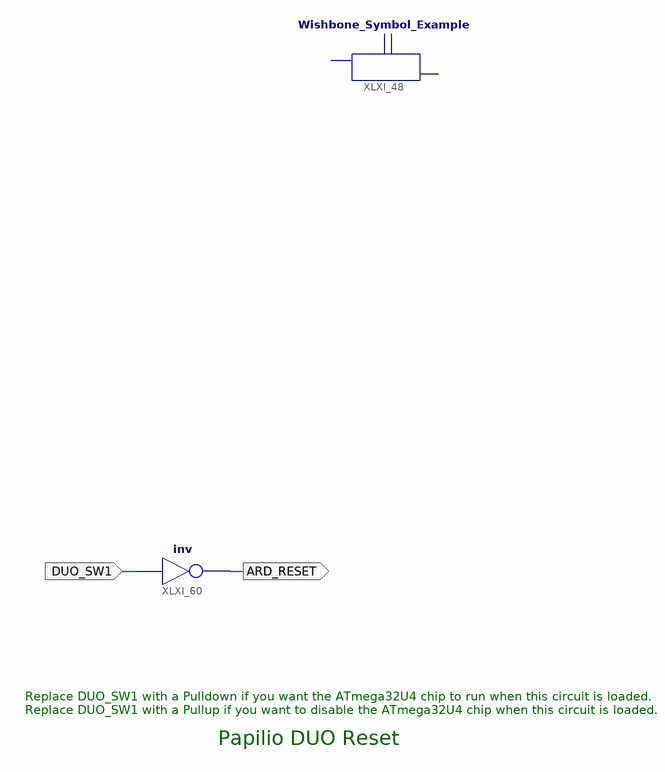
[diagram p0: schematic sheet 1]
// Xilinx ISE schematic Papilio_DUO_LX9.sch (spartan6) as structural Verilog: 2 symbols, 2 ports
module Papilio_DUO_LX9 (
  input  DUO_SW1,
  output ARD_RESET
);

  Wishbone_Symbol_Example XLXI_48 ();  // open: buttons, leds, wishbone_in, wishbone_out
  not XLXI_60 (ARD_RESET, DUO_SW1);

  // Notes on the sheet:
  //   Replace DUO_SW1 with a Pulldown if you want the ATmega32U4 chip to run when this circuit is loaded.
  //   Replace DUO_SW1 with a Pullup if you want to disable the ATmega32U4 chip when this circuit is loaded.
  //   Papilio DUO Reset
endmodule
